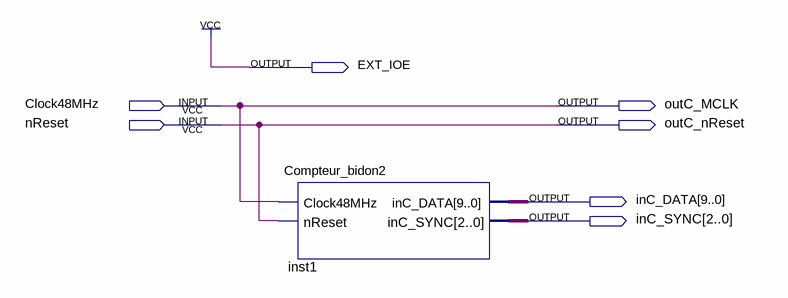
[diagram p0: schematic sheet]
// Quartus schematic ConExt1.bdf as structural Verilog: 1 symbols, 7 pins
module ConExt1 (
  input  Clock48MHz,
  input  nReset,
  output EXT_IOE,
  output outC_MCLK,
  output outC_nReset,
  output [9:0] inC_DATA,
  output [2:0] inC_SYNC
);

  Compteur_bidon2 inst1 (.Clock48MHz(Clock48MHz), .nReset(nReset), .inC_DATA(inC_DATA), .inC_SYNC(inC_SYNC));

  assign EXT_IOE = 1'b1;
  assign outC_MCLK = Clock48MHz;
  assign outC_nReset = nReset;
endmodule
